# EAGLE design MagnetCharger (EAGLE 5.11)

## Sheet 1 of 2
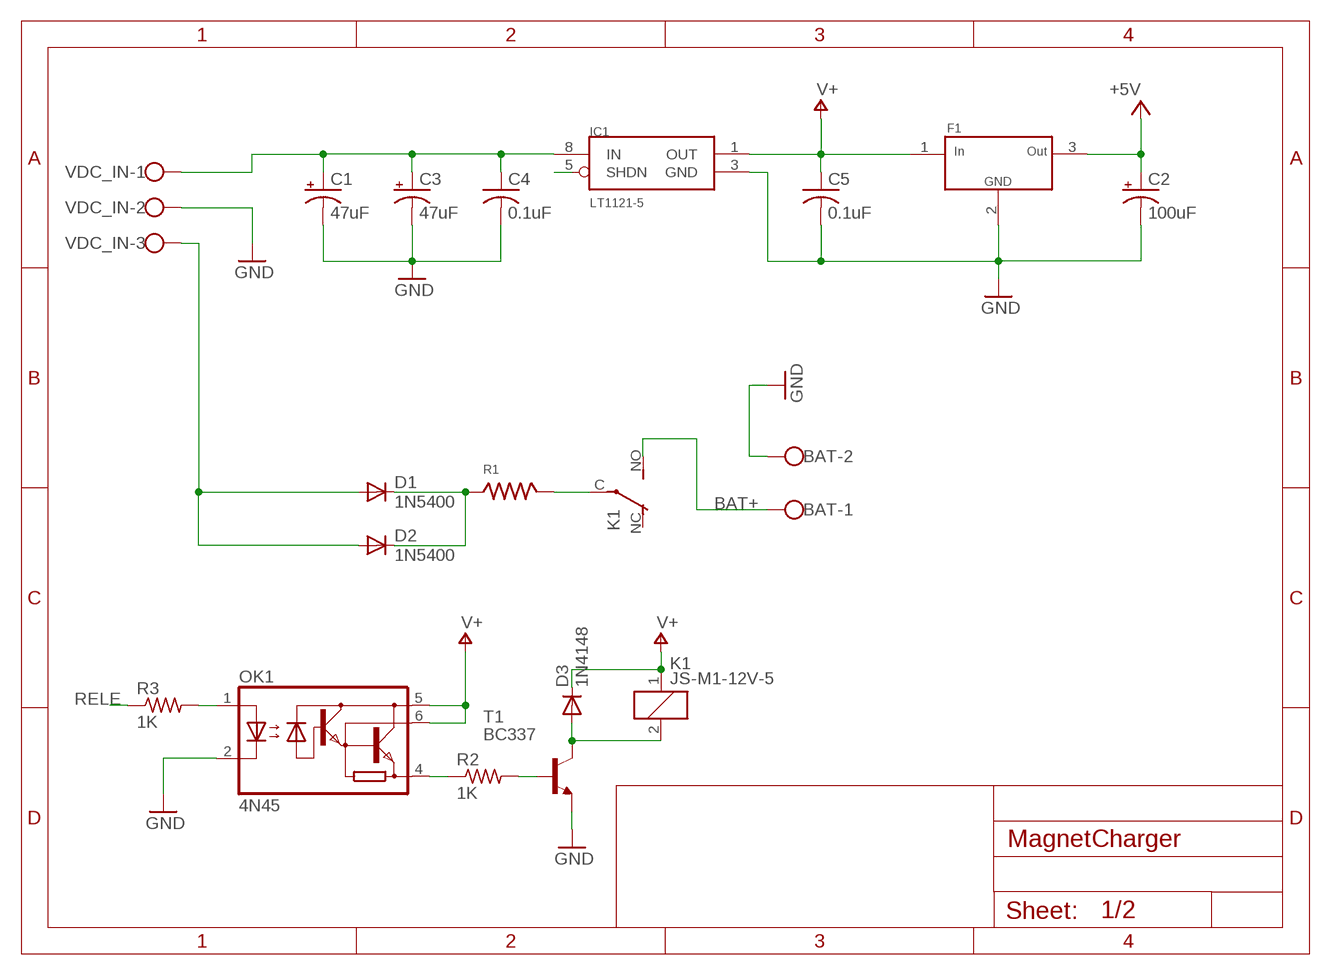
[diagram p0: schematic, sheet 1]

### Parts
BAT  W237-102  [W237-102]
C1  47uF  CPOL-USE  [PANASONIC_E]
C2  100uF  CPOL-USE  [PANASONIC_E]
C3  47uF  CPOL-USE  [PANASONIC_E]
C4  0.1uF  C-USC0603  [C0603]
C5  0.1uF  C-USC0603  [C0603]
D1  1N5400  [DO201-15]
D2  1N5400  [DO201-15]
D3  1N4148  1N4148DO35-10  [DO35-10]
F1  EMIFIL  [NFE-2706]
IC1  LT1121-5  LT1121-3.3  [SO08]
K1  JS-M1-12V-5  [JS-M]
OK1  4N45  [DIL06]
R1  R_10W48MM  [R10W_48MM]
R2  1K  R-US_R0603  [R0603]
R3  1K  R-US_R0603  [R0603]
T1  BC337  [TO92]
VDC_IN  W237-103  [W237-103]

### Nets
+5V: C2.+ F1.3 ; also sheet 2
BAT+: BAT.1 K1.NO(2:S) ; also sheet 2
GND: BAT.2 C1.- C2.- C3.- C4.2 C5.2 F1.2 IC1.3(GND) OK1.2(C) T1.1(E) VDC_IN.2 ; also sheet 2
N$1: OK1.4(GND) R2.1
N$2: C1.+ C3.+ C4.1 IC1.8(IN) VDC_IN.1
N$3: IC1.5(SHDN)
N$4: R2.2 T1.2(B)
N$5: D3.A K1.2 T1.3(C)
N$7: OK1.1(A) R3.2
N$16: D1.A D2.A VDC_IN.3
N$17: D1.C D2.C R1.1
N$18: K1.C(2:P) R1.2
RELE: R3.1 ; also sheet 2
V+: C5.1 D3.C F1.1 IC1.1(OUT) K1.1 OK1.5(VO) OK1.6(B)
Unconnected: K1.NC(2:O)

## Sheet 2 of 2
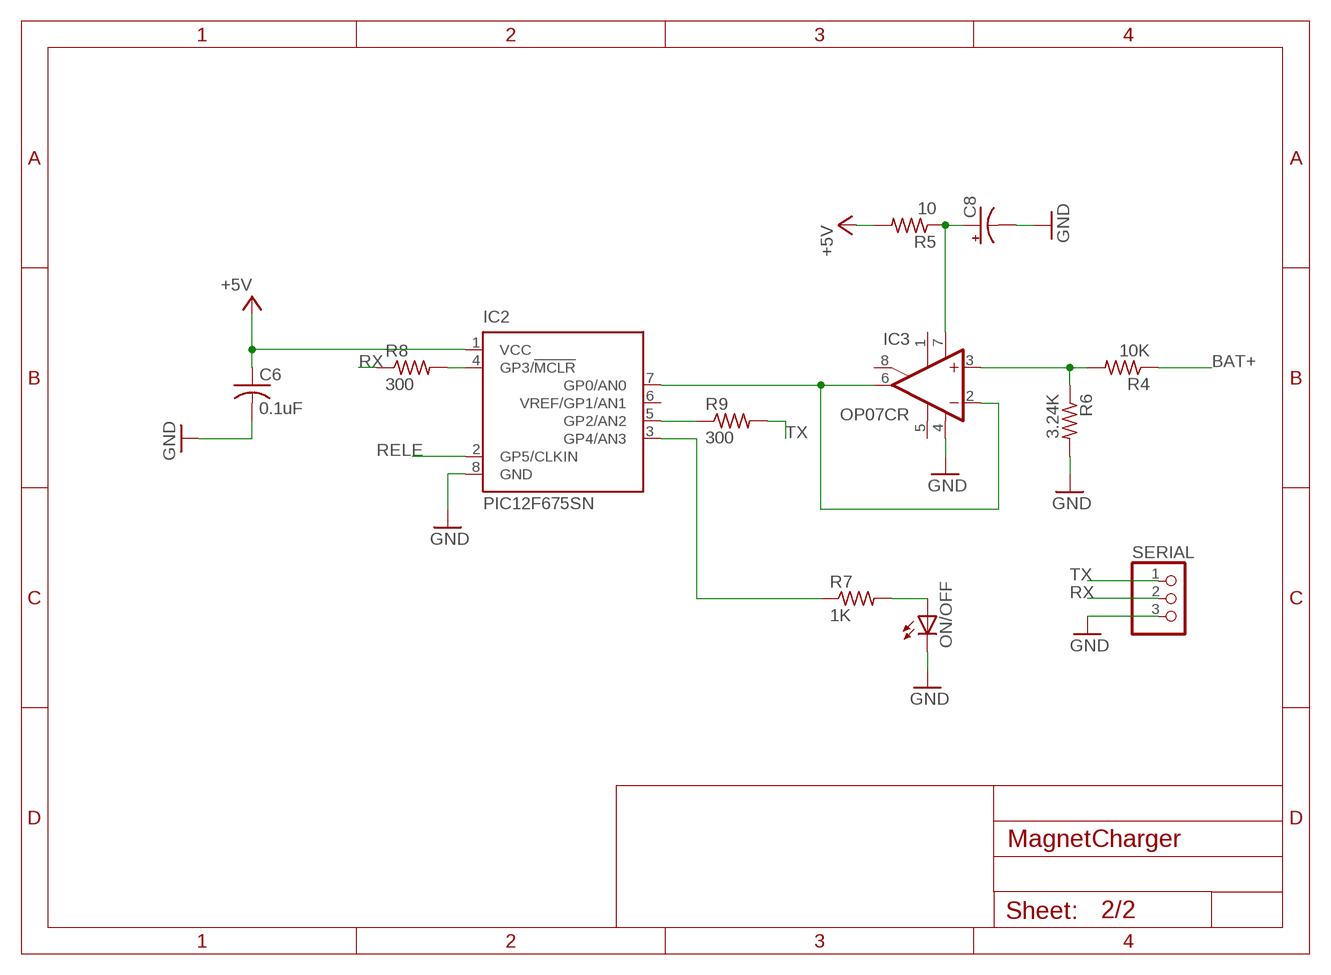
[diagram p1: schematic, sheet 2]

### Parts
C6  0.1uF  C-USC0603  [C0603]
C8  CPOL-USA/3216-18W  [A/3216-18W]
IC2  PIC12F675SN  [SO-08]
IC3  OP07CR  [SO08]
ON/OFF  LED3MM  [LED3MM]
R4  10K  R-US_R0805  [R0805]
R5  10  R-US_R0805  [R0805]
R6  3.24K  R-US_R0805  [R0805]
R7  1K  R-US_R0603  [R0603]
R8  300  R-US_R0603  [R0603]
R9  300  R-US_R0603  [R0603]
SERIAL  PINHD-1X3/90  [1X03/90]

### Nets
+5V: C6.1 IC2.1(VCC) R5.2 ; also sheet 1
BAT+: R4.1 ; also sheet 1
GND: C6.2 C8.- IC2.8(GND) IC3.4(V-) ON/OFF.K(C) R6.2 SERIAL.3 ; also sheet 1
N$6: IC2.7(GP0/AN0) IC3.2(-IN) IC3.6(OUT)
N$8: C8.+ IC3.7(V+) R5.1
N$9: IC2.3(GP4/AN3) R7.1
N$10: IC3.3(+IN) R4.2 R6.1
N$11: ON/OFF.A R7.2
N$19: IC2.4(GP3/!MCLR) R8.2
N$20: IC2.5(GP2/AN2) R9.1
RELE: IC2.2(GP5/CLKIN) ; also sheet 1
RX: R8.1 SERIAL.2
TX: R9.2 SERIAL.1
Unconnected: IC2.6(VREF/GP1/AN1) IC3.1(ON1) IC3.5(OPT) IC3.8(ON2)

## Library data of the parts
BAT = con-wago-500:W237-102: WAGO SCREW CLAMP; MPN: 237-102; OC_FARNELL: unknown; OC_NEWARK: 70K9898
C1-C3 C8 = rcl:CPOL-US: POLARIZED CAPACITOR, American symbol
C4-C6 = rcl:C-US: CAPACITOR, American symbol
D1 D2 = diode:1N5400: DIODE standard rectifier, 3 A, 50 V (Motorola)
D3 = diode:1N4148: DIODE high speed (Philips)
F1 = magnetometro:EMIFIL
IC1 = Ricardo_Library:LT1121-3.3
IC2 = microchip:PIC12F675: 8-Pin FLASH-Based 8-Bit CMOS Microcontroller Precision Internal 4 MHz oscillator factory calibrated to ±1% Low Power Features: Standby Current: - 1 nA @ 2.0V, typical Operating Current: - 8.5µA @ 32 kHz, 2.0V, typical - 100µA @ 1 MHz, 2.0V, typical Watchdog Timer Current: - 300 nA @ 2.0V, typical Timer1 oscillator current: - 4µA @ 32 kHz, 2.0V, typical Analog-to-Digital Converter module: - 10-bit resolution - Programmable 4-channel input - Voltage reference input Source: http://www.microchip.com .. 41190E.pdf; MF: MICROCHIP; MPN: PIC12F675-E/SN; OC_FARNELL: 9759026; OC_NEWARK: 92C4341
IC3 = linear:OP07*: OP AMP
K1 = relay:JS-M1*: Automotive Ultra-Miniature Power Relay NAiS Source: http://www.mew-europe.com/.. en_ds_61211_0000.pdf; MF: FARNELL; MPN: JSM1-12V-5; OC_FARNELL: 910351; OC_NEWARK: 14J1764
OK1 = optocoupler:4N45: MOTOROLA OPTO COUPLER; MF: AGILENT TECHNOLOGIES; MPN: 4N45; OC_FARNELL: unknown; OC_NEWARK: 09F6959
ON/OFF = led:LED: LED OSRAM: - CHIPLED LG R971, LG N971, LY N971, LG Q971, LY Q971, LO R971, LY R971 LH N974, LH R974 LS Q976, LO Q976, LY Q976 LO Q996 - Hyper CHIPLED LW Q18S LB Q993, LB Q99A, LB R99A - SideLED LS A670, LO A670, LY A670, LG A670, LP A670 LB A673, LV A673, LT A673, LW A673 LH A674 LY A675 LS A676, LA A676, LO A676, LY A676, LW A676 LS A679, LY A679, LG A679 - Hyper Micro SIDELED® LS Y876, LA Y876, LO Y876, LY Y876 LT Y87S - SmartLED LW L88C, LW L88S LB L89C, LB L89S, LG L890 LS L89K, LO L89K, LY L89K LS L896, LA L896, LO L896, LY L896 - TOPLED LS T670, LO T670, LY T670, LG T670, LP T670 LSG T670, LSP T670, LSY T670, LOP T670, LYG T670 LG T671, LOG T671, LSG T671 LB T673, LV T673, LT T673, LW T673 LH T674 LS T676, LA T676, LO T676, LY T676, LB T676, LH T676, LSB T676, LW T676 LB T67C, LV T67C, LT T67C, LS T67K, LO T67K, LY T67K, LW E67C LS E67B, LA E67B, LO E67B, LY E67B, LB E67C, LV E67C, LT E67C LW T67C LS T679, LY T679, LG T679 LS T770, LO T770, LY T770, LG T770, LP T770 LB T773, LV T773, LT T773, LW T773 LH T774 LS E675, LA E675, LY E675, LS T675 LS T776, LA T776, LO T776, LY T776, LB T776 LHGB T686 LT T68C, LB T68C - Hyper Mini TOPLED® LB M676 - Mini TOPLED Santana® LG M470 LS M47K, LO M47K, LY M47K Source: http://www.osram.convergy.de LUXEON: - LUMILED® LXK2-PW12-R00, LXK2-PW12-S00, LXK2-PW14-U00, LXK2-PW14-V00 LXK2-PM12-R00, LXK2-PM12-S00, LXK2-PM14-U00 LXK2-PE12-Q00, LXK2-PE12-R00, LXK2-PE12-S00, LXK2-PE14-T00, LXK2-PE14-U00 LXK2-PB12-K00, LXK2-PB12-L00, LXK2-PB12-M00, LXK2-PB14-N00, LXK2-PB14-P00, LXK2-PB14-Q00 LXK2-PR12-L00, LXK2-PR12-M00, LXK2-PR14-Q00, LXK2-PR14-R00 LXK2-PD12-Q00, LXK2-PD12-R00, LXK2-PD12-S00 LXK2-PH12-R00, LXK2-PH12-S00 LXK2-PL12-P00, LXK2-PL12-Q00, LXK2-PL12-R00 Source: www.luxeon.com KINGBRIGHT: KA-3528ASYC Source: www.kingbright.com
R1 = LibraryMagnet:R_10W48MM
R2-R9 = rcl:R-US_: RESISTOR, American symbol
SERIAL = pinhead:PINHD-1X3: PIN HEADER
T1 = transistor:BC337: NPN TRANSISTOR
VDC_IN = con-wago-500:W237-103: WAGO SCREW CLAMP; MPN: 237-103; OC_FARNELL: unknown; OC_NEWARK: 18M7116

## Board
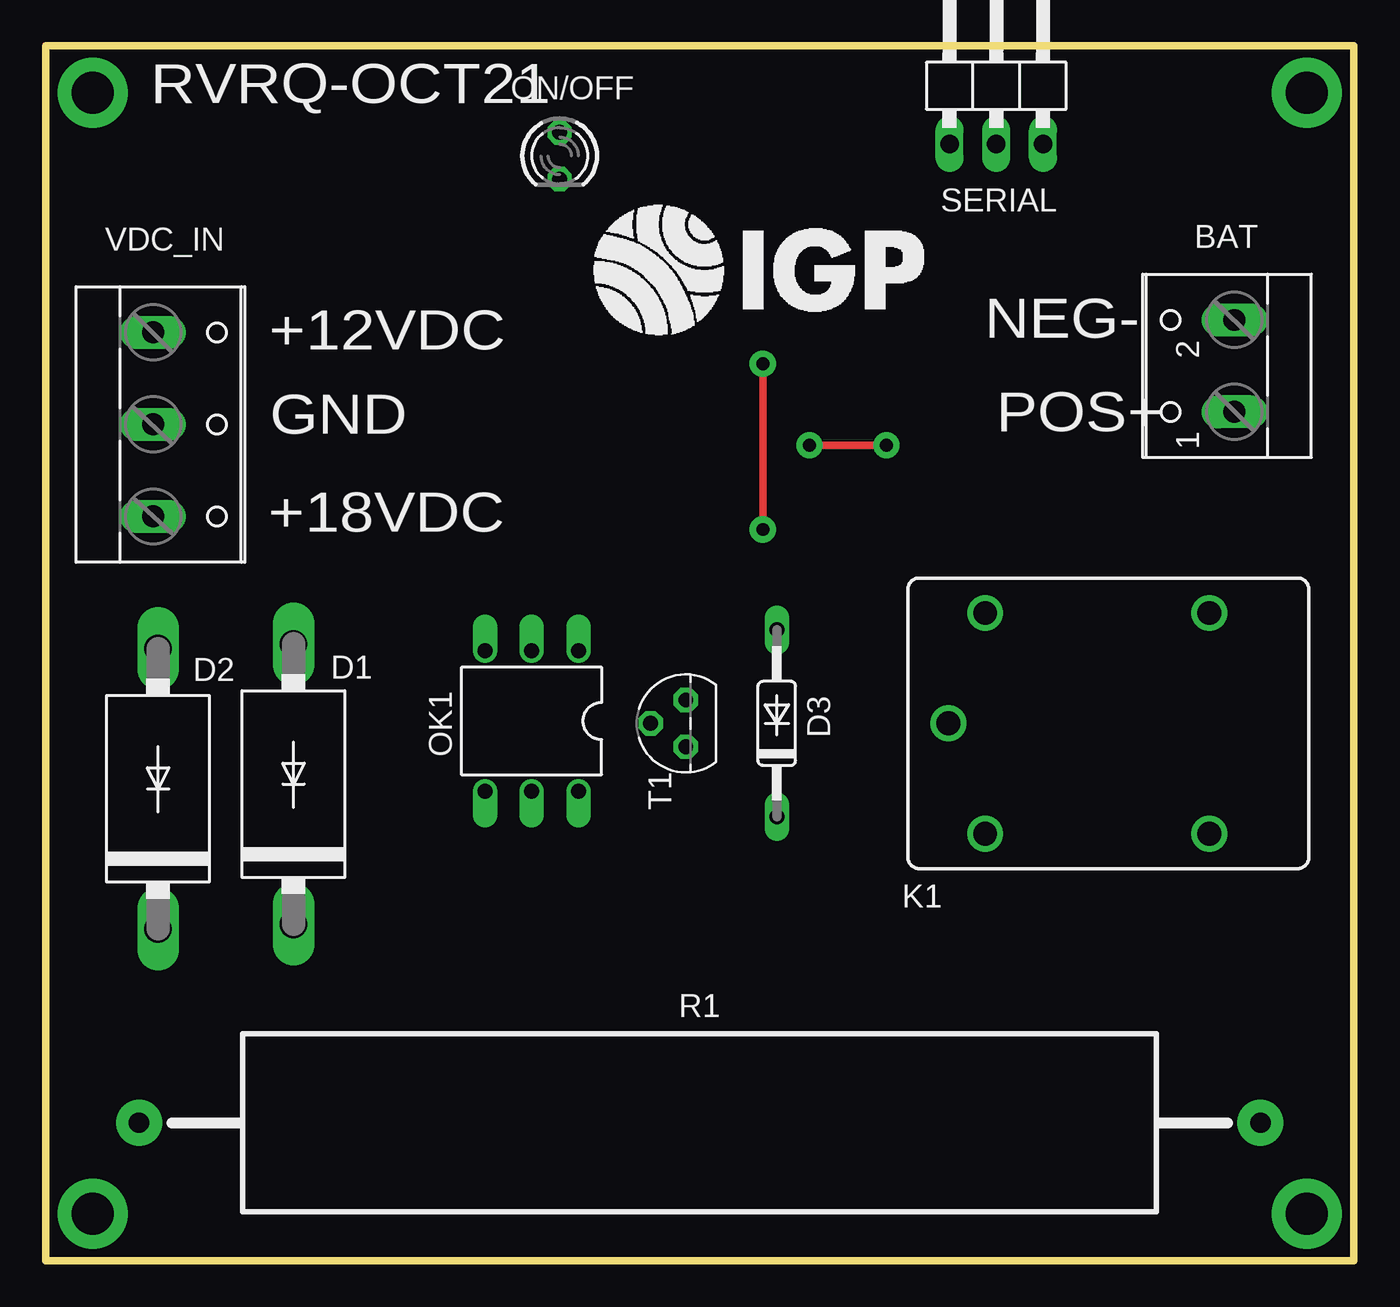
[diagram p2: board, top side]
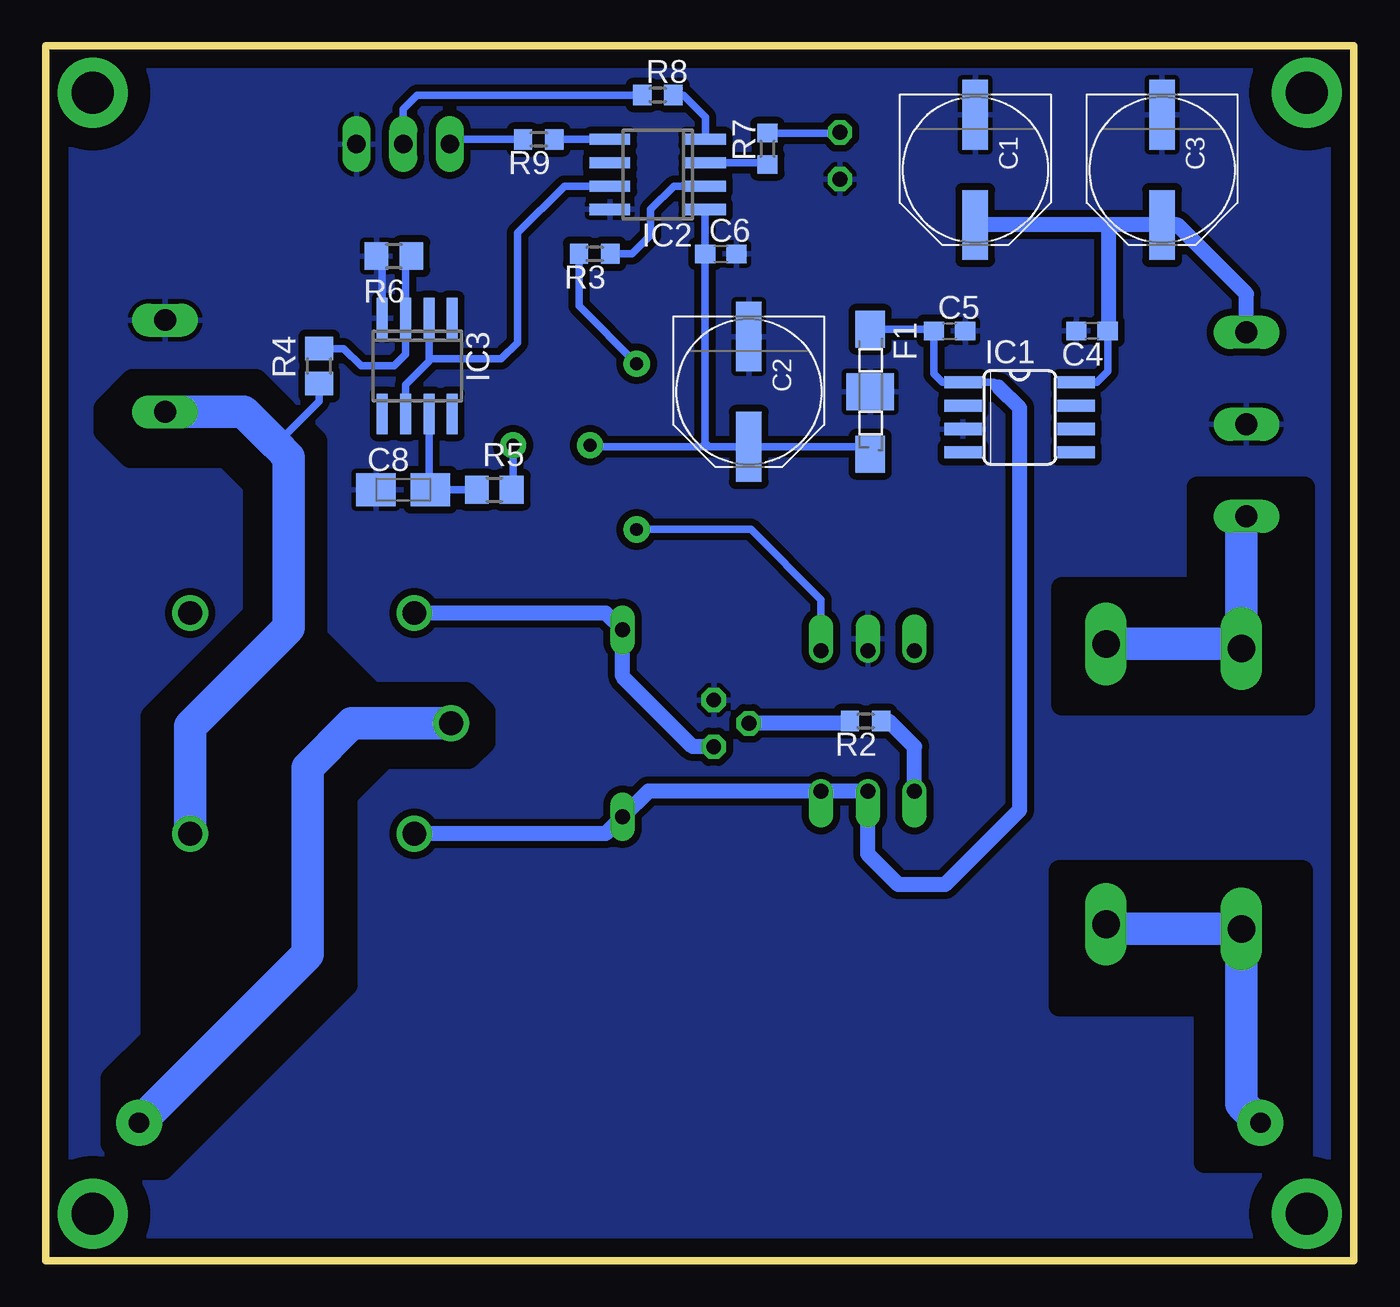
[diagram p3: board, bottom side, seen from below]

Size 71.12 x 66.04 mm. Coordinates in mm from the lower left corner, seen from the top.
Outline: 0,0 0,66.04 71.12,66.04 71.12,0 0,0
Copper layers (1*16): Top 0.035mm / dielectric 1.5mm / Bottom 0.035mm
Design rules "default": minimum track width 10mil, minimum drill 24mil, track to track 8mil, track to pad 8mil, pad to pad 8mil, via to via 8mil, smd to smd 8mil, copper to edge 40mil, drill to drill 8mil, minimum pad ring 10mil, minimum via ring 8mil, stop-mask expansion 4mil, vias tented up to drill 0mil, thermal gap 10mil
bRestrict: area 0,61 to 5.1,66; area 66,61 to 71.1,66; area 66,0 to 71.1,5.1; area 0,0 to 5.1,5.1; 36 lines

### Footprints (pad centres in the part's own frame; a part is rotated, then mirrored left to right if it is on the bottom)
W237-102 = drill 1.194 long: 1 -2.5,-0.381; 2 2.5,-0.381
PANASONIC_E = smd 3.8 x 1.4: + 3,0; - -3,0
C0603 = smd 1.1 x 1: 1 -0.85,0; 2 0.85,0
A/3216-18W = smd 2.15 x 1.8: + 1.475,0; - -1.475,0
DO201-15 = drill 1.499 long: A 7.62,0; C -7.62,0
DO35-10 = drill 0.813 long: A 5.08,0; C -5.08,0
NFE-2706 = smd 2 x 1.6: 1 -3.4,0; 3 3.4,0 | smd 2 x 2.6: 2 0,0
SO08 = smd 0.66 x 2.032: 1 -1.905,-3.073; 2 -0.635,-3.073; 3 0.635,-3.073; 4 1.905,-3.073; 5 1.905,3.073; 6 0.635,3.073; 7 -0.635,3.073; 8 -1.905,3.073
SO-08 = smd 0.6 x 2.2: 1 -1.905,-2.6; 2 -0.635,-2.6; 3 0.635,-2.6; 4 1.905,-2.6; 5 1.905,2.6; 6 0.635,2.6; 7 -0.635,2.6; 8 -1.905,2.6
SO08' = smd 0.6 x 2.2: 1 -1.905,-2.6; 2 -0.635,-2.6; 3 0.635,-2.6; 4 1.905,-2.6; 5 1.905,2.6; 6 0.635,2.6; 7 -0.635,2.6; 8 -1.905,2.6
JS-M = drill 1.3 round: 1 6.7,6; 2 6.7,-6; C 8.7,0; NC -5.5,-6; NO -5.5,6
DIL06 = drill 0.813 offset: 1 -2.54,-3.81; 2 0,-3.81; 3 2.54,-3.81; 4 2.54,3.81; 5 0,3.81; 6 -2.54,3.81
LED3MM = drill 0.813 octagon: A -1.27,0; K 1.27,0
R10W_48MM = drill 1.1 pad 2.5 round: 1 -30.5,0; 2 30.5,0
R0603 = smd 1 x 1.1: 1 -0.85,0; 2 0.85,0
R0805 = smd 1.3 x 1.5: 1 -0.95,0; 2 0.95,0
1X03/90 = drill 1.016 long: 1 -2.54,-3.81; 2 0,-3.81; 3 2.54,-3.81
TO92 = drill 0.813 octagon: 1 1.27,0; 2 0,1.905; 3 -1.27,0
W237-103 = drill 1.194 long: 1 -5,-1.29; 2 0,-1.29; 3 5,-1.29

### Placement (x,y rotation side)
BAT  64.26,48.64 90 top
C1  20.57,59.31 270 bottom
C2  32.89,47.24 270 bottom
C3  10.41,59.31 270 bottom
C4  14.22,50.55 180 bottom
C5  21.97,50.55 0 bottom
C6  34.42,54.74 0 bottom
C8  51.69,41.91 0 bottom
D1  13.46,25.91 90 top
D2  6.1,25.65 90 top
D3  39.75,29.21 90 top
F1  26.29,47.24 270 bottom
IC1  18.16,45.85 270 bottom
IC2  37.85,59.05 90 bottom
IC3  OP07CR  [SO08']  50.93,48.64 180 bottom
K1  57.78,29.21 180 top
OK1  26.42,29.34 180 top
ON/OFF  27.94,60.07 270 top
R1  35.56,7.49 0 top
R2  26.54,29.34 180 bottom
R3  41.27,54.74 180 bottom
R4  56.26,48.64 90 bottom
R5  46.74,41.91 0 bottom
R6  52.2,54.61 180 bottom
R7  31.88,60.45 90 bottom
R8  37.85,63.37 0 bottom
R9  44.32,60.96 180 bottom
SERIAL  51.69,64.52 0 top
T1  34.8,29.21 90 top
VDC_IN  7.11,45.47 270 top

### Tracks (layer width: path | path; a pad name or v marks a point on that pad's centre or on a via)
+5V  (via drill 0.7 pad 1.42)
  Top 0.406: v41.53,44.32 v45.72,44.32
  Bottom 0.406: IC2.1 35.27,57.13 C6.1 35.27,44.46 35.05,44.24 | F1.3 26.69,44.24 C2.+ 35.05,44.24 | 35.05,44.24 41.45,44.24 v41.53,44.32 | v45.72,44.32 45.72,41.98 R5.2
BAT+
  Bottom 0.406: R4.1 56.26,46.74 58.61,44.39
  Bottom 1.778: K1.NO 63.28,29.04 57.91,34.42 57.91,43.69 58.61,44.39 60.37,46.14 BAT.1
GND
  Bottom 0.406: IC3.4 52.83,54.3 R6.2
  pour Bottom (isolate 0.381): -0.64,66.55 72.26,66.55 72.26,-0.76 -0.64,-0.76
N$1
  Bottom 0.406: 25.27,29.34 R2.1
  Bottom 0.813: OK1.4 23.88,27.94 25.27,29.34
N$2
  Bottom 0.406: 13.37,50.47 C4.1 13.37,48.35 13.97,47.75 IC1.8
  Bottom 0.813: VDC_IN.1 5.82,52.56 9.57,56.31 C3.+ 13.34,56.31 | 13.34,56.31 C1.+ | C4.1 13.34,50.59 13.34,56.31
N$4
  Bottom 0.406: R2.2 27.52,29.21
  Bottom 0.813: 27.52,29.21 T1.2
N$5
  Bottom 0.813: T1.3 35.94,27.94 39.75,31.75 D3.A 40.67,35.21 K1.2
N$6
  Bottom 0.406: IC3.6 51.56,47.62 50.29,48.9 50.29,49.02 | 50.29,49.02 IC3.2 | IC2.7 42.93,58.42 45.47,55.88 45.47,49.91 46.35,49.02 50.29,49.02
N$7  (via drill 0.7 pad 1.42)
  Top 0.406: v38.99,39.75 v38.99,48.77
  Bottom 0.406: R3.2 42.12,51.9 v38.99,48.77 | v38.99,39.75 32.77,39.75 28.96,35.94 OK1.1
N$8
  Bottom 0.406: R5.1 C8.+ 50.29,41.91 IC3.7
N$9
  Bottom 0.406: IC2.3 31.96,59.69 R7.1
N$10
  Bottom 0.406: R6.1 51.56,54.3 IC3.3 51.56,49.28 52.2,48.64 53.98,48.64 54.92,49.59 R4.2
N$11
  Bottom 0.406: R7.2 27.98,61.3 ON/OFF.A
N$12  (via drill 2.29 pad 3.81)
  other vias: 2.54,2.54
N$13  (via drill 2.29 pad 3.81)
  other vias: 68.58,2.54
N$14  (via drill 2.29 pad 3.81)
  other vias: 2.54,63.5
N$15  (via drill 2.29 pad 3.81)
  other vias: 68.58,63.5
N$16
  Bottom 1.778: VDC_IN.3 6.1,40.19 D2.A 6.35,33.53 D1.A
N$17
  Bottom 1.778: D1.C 13.21,18.03 D2.C 6.1,8.53 R1.1
N$18
  Bottom 1.778: K1.C 54.48,29.21 56.9,26.8 56.9,16.66 R1.2
N$19
  Bottom 0.406: IC2.4 35.25,62.17 36.45,63.37 R8.2
N$20
  Bottom 0.406: IC2.5 R9.1
RELE
  Bottom 0.406: IC2.2 36.96,58.42 38.23,57.15 38.23,55.75 39.24,54.74 R3.1
RX
  Bottom 0.406: R8.1 50.93,63.37 51.69,62.61 SERIAL.2
TX
  Bottom 0.406: R9.2 48.9,60.96 SERIAL.1
V+
  Bottom 0.406: 19.3,47.5 19.56,47.75 IC1.1 22.35,47.75 22.82,48.22 C5.1 22.92,50.64 F1.1
  Bottom 0.813: 19.3,47.5 18.16,46.35 18.16,24.51 22.23,20.45 24.77,20.45 26.42,22.1 OK1.5 OK1.6 38.35,25.53 D3.C 40.67,23.21 K1.1

### Text on the board
tPlace: RVRQ-OCT21 | +12VDC | NEG- | GND | POS+ | +18VDC